# Altium schematic sheet Transceivers.SchDoc: Transceivers
size A3; CompanyName: Green Team Twente; Organization: Green Team Twente; Revision: V1.1; SheetNumber: 6; SheetTotal: 10; Team: 2024; Subsystem: Embedded Systems; SPICEModelCacheTCQGJEKV: <root> / <DocumentId>TCQGJEKV</DocumentId> / </root>
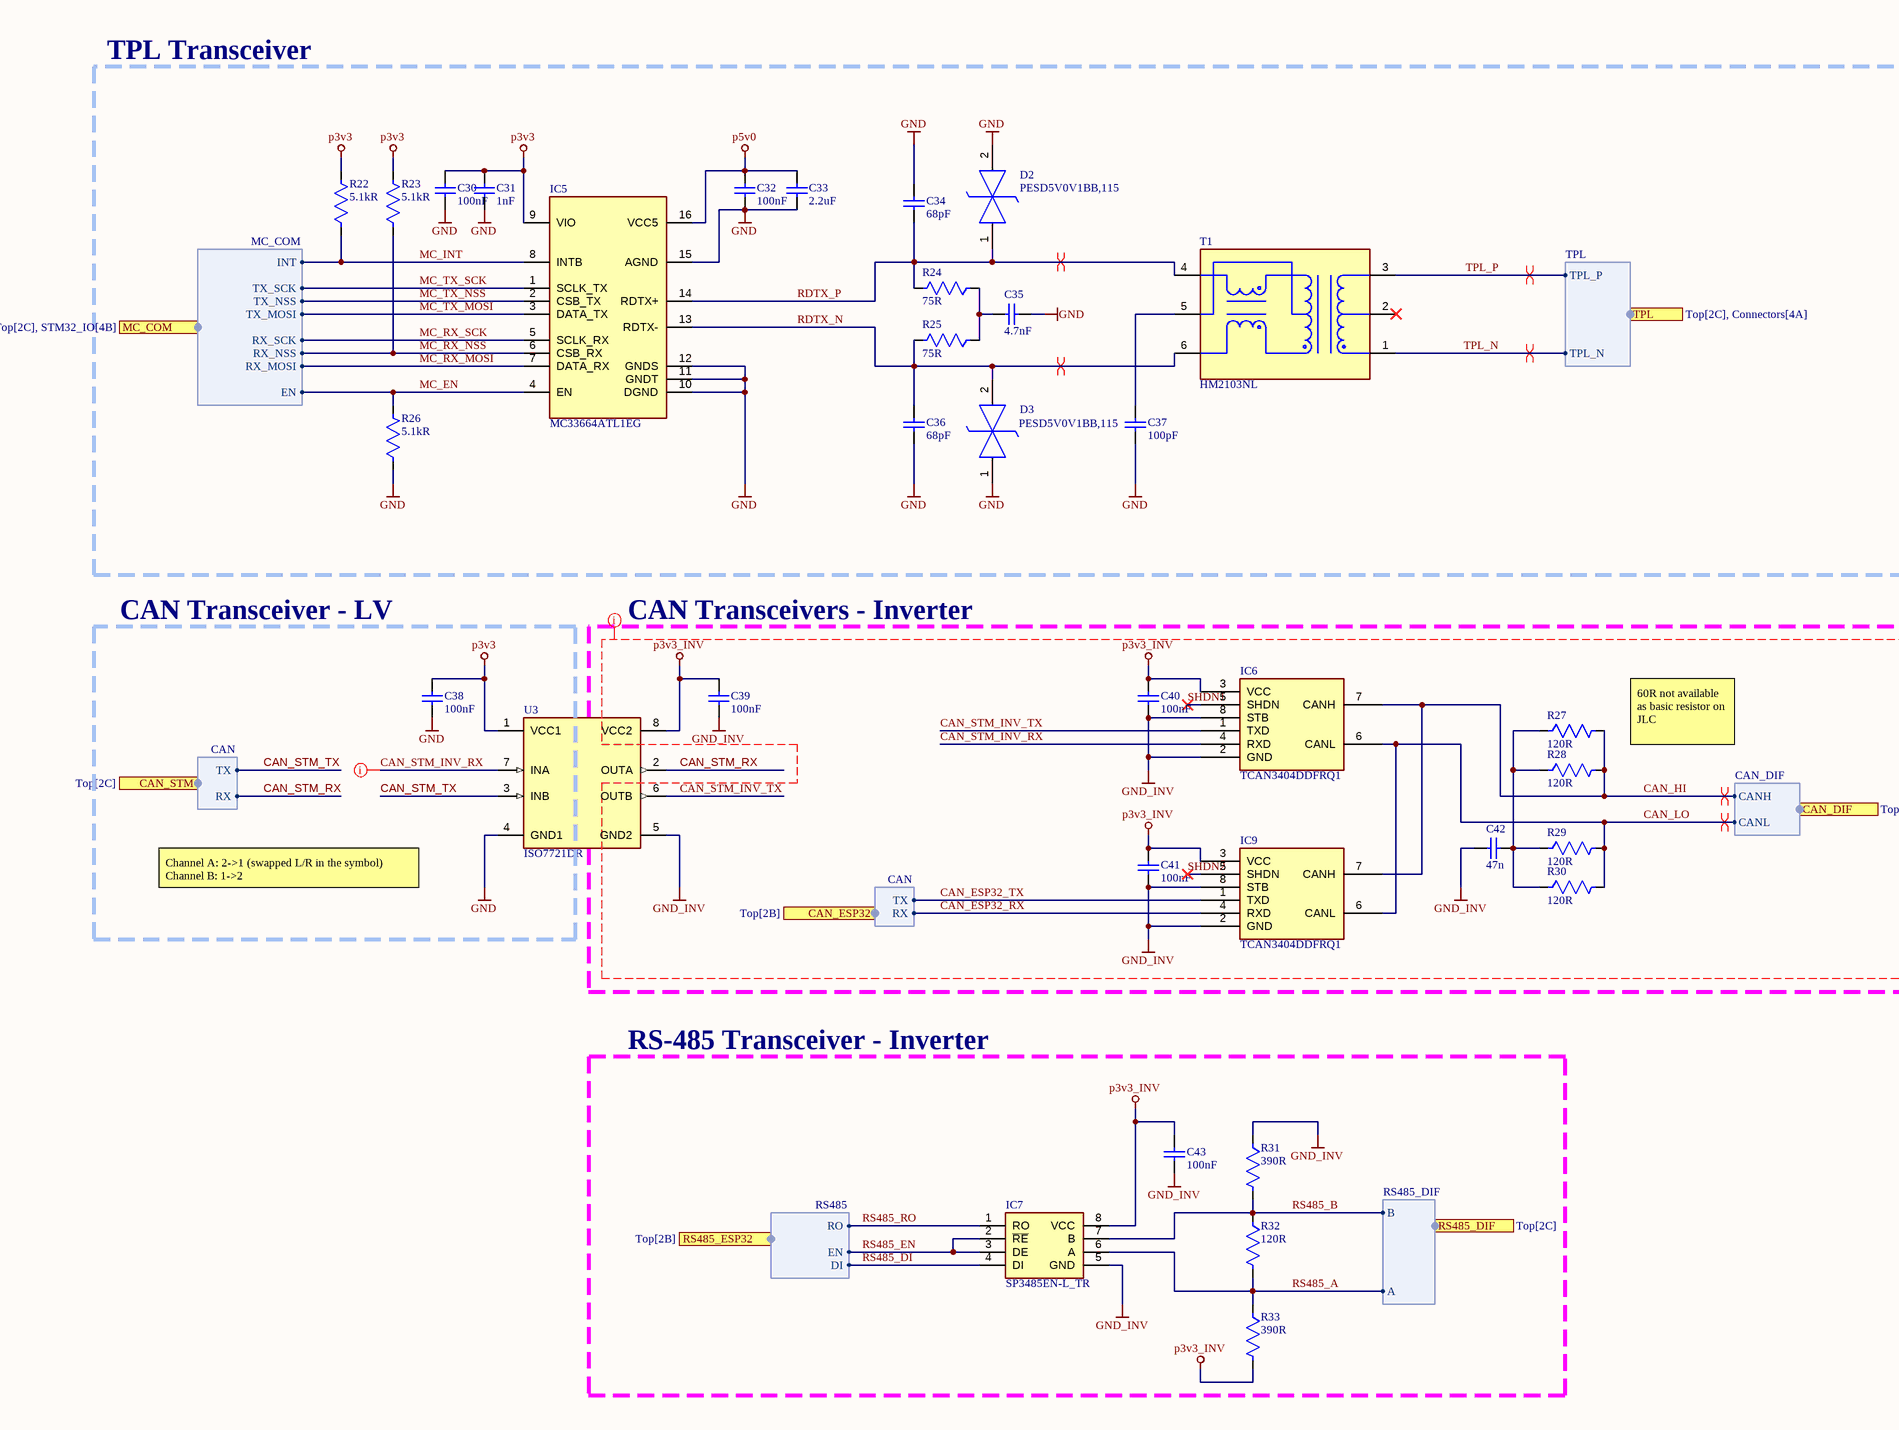
[diagram p0: Transceivers.SchDoc, left]
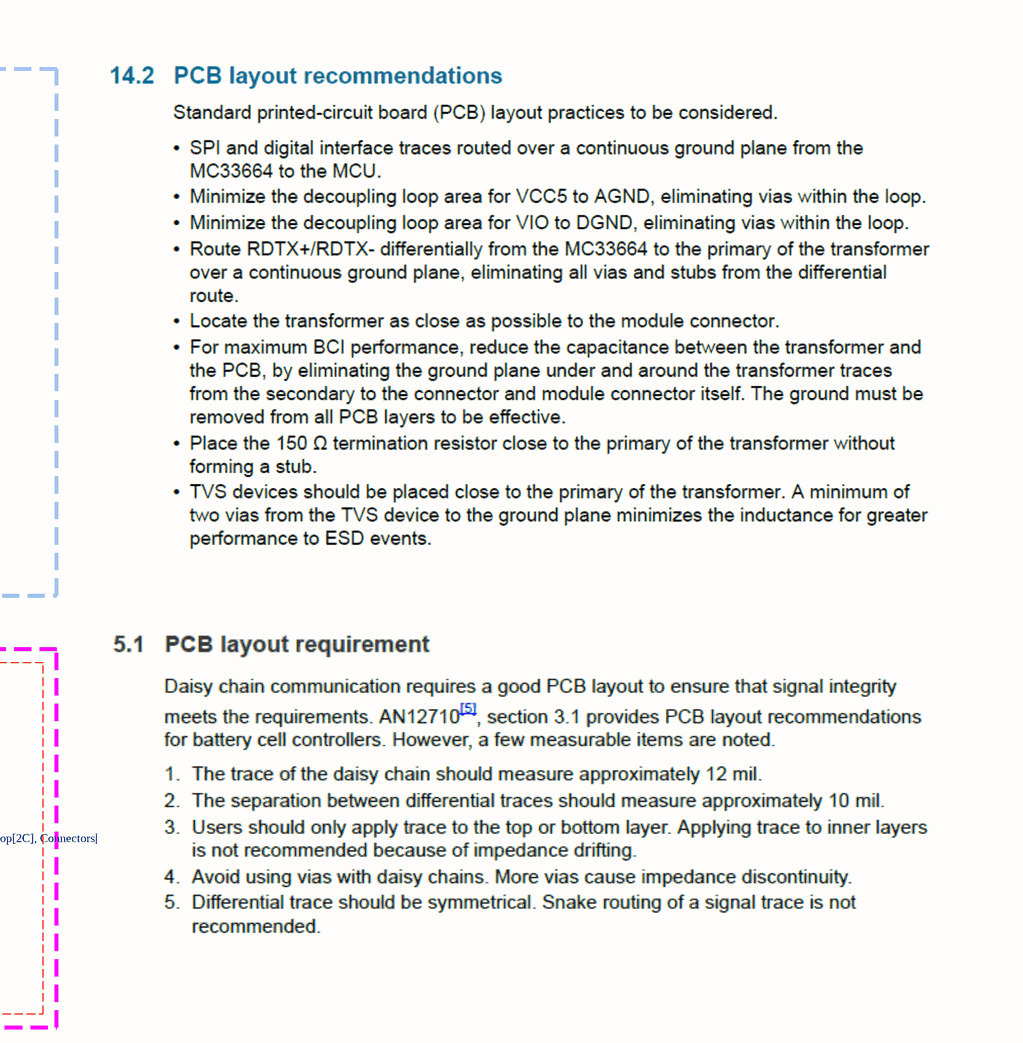
[diagram p1: Transceivers.SchDoc, right]

## Parts
C30  value 100nF  [WCAP-CSGP_0402_L1W0.5H0.5]  (hidden comment: CAP 0402 100nF X7R)
C31  value 1nF  [WCAP-CSGP_0402_L1W0.5H0.5]  (hidden comment: CAP 0402 1nF X7R)
C32  value 100nF  [WCAP-CSGP_0402_L1W0.5H0.5]  (hidden comment: CAP 0402 100nF X7R)
C33  value 2.2uF  [WCAP-CSGP_0603_L1.6W0.8H0.8_Reflow]  (hidden comment: CAP 0603 2.2uF X7R)
C34  value 68pF  [WCAP-CSGP_0402_L1W0.5H0.5]  (hidden comment: CAP 0402 68pF X7R)
C35  value 4.7nF  [WCAP-CSGP_0402_L1W0.5H0.5]  (hidden comment: CAP 0402 4.7nF X7R)
C36  value 68pF  [WCAP-CSGP_0402_L1W0.5H0.5]  (hidden comment: CAP 0402 68pF X7R)
C37  value 100pF  [WCAP-CSGP_0402_L1W0.5H0.5]  (hidden comment: CAP 0402 100pF X7R)
C38  value 100nF  [WCAP-CSGP_0402_L1W0.5H0.5]  (hidden comment: CAP 0402 100nF X7R)
C39  value 100nF  [WCAP-CSGP_0402_L1W0.5H0.5]  (hidden comment: CAP 0402 100nF X7R)
C40  value 100nF  [WCAP-CSGP_0402_L1W0.5H0.5]  (hidden comment: CAP 0402 100nF X7R)
C41  value 100nF  [WCAP-CSGP_0402_L1W0.5H0.5]  (hidden comment: CAP 0402 100nF X7R)
C42  value 47n  [WCAP-CSGP_0603_L1.6W0.8H0.8_Reflow]  (hidden comment: CAP 0603 47n X7R)
C43  value 100nF  [WCAP-CSGP_0402_L1W0.5H0.5]  (hidden comment: CAP 0402 100nF X7R)
D2  PESD5V0V1BB,115  [PESD5V0V1BB115]
D3  PESD5V0V1BB,115  [PESD5V0V1BB115]
IC5  MC33664ATL1EG  [SOIC127P600X175-16N]
IC6  TCAN3404DDFRQ1  [TSOT-23-8]
IC7  SP3485EN-L_TR  [SOIC127P600X175-8N]
IC9  TCAN3404DDFRQ1  [TSOT-23-8]
R22  value 5.1kR  [FP0402]  (hidden comment: RES 0402 5.1kR 1%)
R23  value 5.1kR  [FP0402]  (hidden comment: RES 0402 5.1kR 1%)
R24  value 75R  [RES_SM0603_YAGEORC_N]  (hidden comment: RES 0603 75R 1%)
R25  value 75R  [RES_SM0603_YAGEORC_N]  (hidden comment: RES 0603 75R 1%)
R26  value 5.1kR  [FP0402]  (hidden comment: RES 0402 5.1kR 1%)
R27  value 120R  [RES_SM0603_YAGEORC_N]  (hidden comment: RES 0603 120R 1%)
R28  value 120R  [RES_SM0603_YAGEORC_N]  (hidden comment: RES 0603 120R 1%)
R29  value 120R  [RES_SM0603_YAGEORC_N]  (hidden comment: RES 0603 120R 1%)
R30  value 120R  [RES_SM0603_YAGEORC_N]  (hidden comment: RES 0603 120R 1%)
R31  value 390R  [RES_SM0603_YAGEORC_N]  (hidden comment: RES 0603 390R 1%)
R32  value 120R  [RES_SM0603_YAGEORC_N]  (hidden comment: RES 0603 120R 1%)
R33  value 390R  [RES_SM0603_YAGEORC_N]  (hidden comment: RES 0603 390R 1%)
T1  HM2103NL  [FP-HM2103NL-MFG]
U3  ISO7721DR  [FP-D0008B-MFG]

## Blocks framed on the sheet
TPL Transceiver: C30-C37 D2 D3 IC5 R22-R26 T1
CAN Transceiver - LV: C38
CAN Transceivers - Inverter: C39-C42 IC6 IC9 R27-R30
RS-485 Transceiver - Inverter: C43 IC7 R31-R33

## Ports
CAN_DIF (out, harness CAN_DIF, see Top[2C], Connectors[1A]), CAN_ESP32 (out, harness CAN, see Top[2B]), CAN_STM (out, harness CAN, see Top[2C]), MC_COM (out, harness MC_COM, see Top[2C], STM32_IO[4B]), RS485_DIF (out, harness RS485_DIF, see Top[2C]), RS485_ESP32 (out, harness RS485, see Top[2B]), TPL (out, harness TPL, see Top[2C], Connectors[4A])

## Harnesses
CAN: RX, TX
MC_COM: INT, TX_SCK, TX_NSS, TX_MOSI, RX_SCK, RX_NSS, RX_MOSI, EN
CAN_DIF: CANH, CANL
TPL: TPL_P, TPL_N
CAN: TX, RX
RS485_DIF: A, B
RS485: RO, EN, DI

## Nets
GND: C30.1 C31.1 C32.1 C33.1 C34.2 C35.1 C36.1 C37.1 C38.1 D2.2(K2) D3.1(K1) IC5.10(DGND) IC5.11(GNDT) IC5.12(GNDS) IC5.15(AGND) R26.1 U3.4(GND1)
GND_INV: C39.1 C40.1 C41.1 C42.2 C43.1 IC6.2(GND) IC6.8(STB) IC7.5(GND) IC9.2(GND) IC9.8(STB) R31.1 U3.5(GND2)
p3v3: C30.2 C31.2 C38.2 IC5.9(VIO) R22.2 R23.2 U3.1(VCC1)
p3v3_INV: C39.2 C40.2 C41.2 C43.2 IC6.3(VCC) IC7.8(VCC) IC9.3(VCC) R33.2 U3.8(VCC2)
p5v0: C32.2 C33.2 IC5.16(VCC5)
CAN_ESP32_RX: IC9.4(RXD) ; port CAN_ESP32.RX
CAN_ESP32_TX: IC9.1(TXD) ; port CAN_ESP32.TX
CAN_HI: IC6.7(CANH) IC9.7(CANH) R27.2 R28.2 ; port CAN_DIF.CANH
CAN_LO: IC6.6(CANL) IC9.6(CANL) R29.2 R30.2 ; port CAN_DIF.CANL
CAN_STM_INV_RX: IC6.4(RXD) U3.7(INA)
CAN_STM_INV_TX: IC6.1(TXD) U3.6(OUTB)
CAN_STM_RX: U3.2(OUTA) ; port CAN_STM.RX
CAN_STM_TX: U3.3(INB) ; port CAN_STM.TX
MC_EN: IC5.4(EN) R26.2 ; port MC_COM.EN
MC_INT: IC5.8(INTB) R22.1 ; port MC_COM.INT
MC_RX_MOSI: IC5.7(DATA_RX) ; port MC_COM.RX_MOSI
MC_RX_NSS: IC5.6(CSB_RX) R23.1 ; port MC_COM.RX_NSS
MC_RX_SCK: IC5.5(SCLK_RX) ; port MC_COM.RX_SCK
MC_TX_MOSI: IC5.3(DATA_TX) ; port MC_COM.TX_MOSI
MC_TX_NSS: IC5.2(CSB_TX) ; port MC_COM.TX_NSS
MC_TX_SCK: IC5.1(SCLK_TX) ; port MC_COM.TX_SCK
RDTX_N: C36.2 D3.2(K2) IC5.13(RDTX-) R25.2 T1.6
RDTX_P: C34.1 D2.1(K1) IC5.14(RDTX+) R24.2 T1.4
RS485_A: IC7.6(A) R32.2 R33.1 ; port RS485_DIF.A
RS485_B: IC7.7(B) R31.2 R32.1 ; port RS485_DIF.B
RS485_DI: IC7.4(DI) ; port RS485_ESP32.DI
RS485_EN: IC7.2(~{RE}) IC7.3(DE) ; port RS485_ESP32.EN
RS485_RO: IC7.1(RO) ; port RS485_ESP32.RO
SHDN1: IC6.5(SHDN)
SHDN2: IC9.5(SHDN)
TPL_N: T1.1 ; port TPL.TPL_N
TPL_P: T1.3 ; port TPL.TPL_P
NetC35_2: C35.2 R24.1 R25.1
NetC37_2: C37.2 T1.5
NetC42_1: C42.1 R27.1 R28.1 R29.1 R30.1

Not connected (* = marked no-connect by the designer): T1 2*

## Layout directives
differential pair; differential pair class CAN120; rule Clearance Constraint [Generic clearance = 0.15mm, and 12 value(s) for objects]: CAN_HI, CAN_LO
differential pair; differential pair class TPL100; rule Clearance Constraint [Generic clearance = 0.15mm, and 12 value(s) for objects]: RDTX_N, RDTX_P, TPL_N, TPL_P
net class INV: CAN_ESP32_RX, CAN_ESP32_TX, CAN_HI, CAN_LO, CAN_STM_INV_RX, CAN_STM_INV_TX, GND_INV, p3v3_INV, SHDN1, SHDN2

## Notes on the sheet
- 60R not available as basic resistor on JLC
- Channel A: 2->1 (swapped L/R in the symbol)
  Channel B: 1->2
- Team
- Authors
- Revision
- Title
- Project
- Subsystem
- File
- Sheet
- //

## Library data of the parts
C30-C32 C34-C41 C43 = CMP-001-01308-5: GTT Standard 0402 non-polarized capacitor; Pins: 2; Case/Package: 0402; Category: Multilayer Ceramic Chip Capacitors; Ceramic Type: X7R; ClassName: TPL_Trans
  C30 C32 C38-C41 C43: JLCPCB Part #: C1525
  C31: JLCPCB Part #: C1523
  C34 C36: JLCPCB Part #: C190580
  C35: JLCPCB Part #: C1538
  C37: JLCPCB Part #: C1546
C33 C42 = CMP-001-01309-1: GTT Standard 0603 non-polarized capacitor; Case/Package: 0603; Category: Multilayer Ceramic Chip Capacitors; Ceramic Type: X7R; Pins: 2
  C33: ClassName: TPL_Trans; JLCPCB Part #: C23630
  C42: JLCPCB Part #: C1622
D2 D3 = CMP-004-00097-1: PESD5V0V1BB - Very low capacitance bidirectional ESD protection diode; Manufacturer_Name: Nexperia; Arrow Price/Stock: https://www.arrow.com/en/products/pesd5v0v1bb115/nexperia?region=nac; Design Item ID: PESD5V0V1BB,115; Height: 0.65mm; Manufacturer_Part_Number: PESD5V0V1BB,115; Mouser Price/Stock: https://www.mouser.co.uk/ProductDetail/Nexperia/PESD5V0V1BB115?qs=GcY6OjH1zdkfLKV5vNnV%252BA%3D%3D; Datasheet Link: https://assets.nexperia.com/documents/data-sheet/PESD5V0V1BB.pdf; Mouser Part Number: 771-PESD5V0V1BB115; Source: TempSchematics.schlib; Arrow Part Number: PESD5V0V1BB,115
IC5 = CMP-031-00034-2: Interface - Specialized Isolated network high speed transceiver; Manufacturer_Name: NXP; Height: 1.75mm; Source: TempSchematics.schlib; Arrow Part Number: MC33664ATL1EG; Mouser Part Number: 841-MC33664ATL1EG; Mouser Price/Stock: https://www.mouser.co.uk/ProductDetail/NXP-Semiconductors/MC33664ATL1EG?qs=ifm8N2KdrcYav8QSnSftXQ%3D%3D; Design Item ID: MC33664ATL1EG; Datasheet Link: http://www.nxp.com/docs/en/data-sheet/MC33664_SDS.pdf; Manufacturer_Part_Number: MC33664ATL1EG; Arrow Price/Stock: https://www.arrow.com/en/products/mc33664atl1eg/nxp-semiconductors?region=nac
IC6 IC9 = TCAN3404DDFRQ1: Integrated Circuit; Manufacturer_Name: TI; Datasheet Link: https://www.ti.com/lit/ds/symlink/tcan3404-q1.pdf; Height: 1.1mm; Manufacturer_Part_Number: TCAN3404DDFRQ1; JLCPCB Part #: C32428067
IC7 = SP3485EN-L_TR: Integrated Circuit; Manufacturer_Name: MaxLinear; Manufacturer_Part_Number: SP3485EN-L/TR; Datasheet Link: https://www.maxlinear.com/ds/sp3485.pdf; Height: 1.75mm; Mouser Part Number: 701-SP3485EN-L/TR; Mouser Price/Stock: https://www.mouser.co.uk/ProductDetail/MaxLinear/SP3485EN-L-TR?qs=3EMgrMjM0fbQ17liGrle%2Fg%3D%3D; Arrow Part Number: SP3485EN-L/TR; Arrow Price/Stock: https://www.arrow.com/en/products/sp3485en-ltr/maxlinear-inc?region=nac; JLCPCB Part #: C8963
R22 R23 R26 = CMP-009-00204-17: GTT Standard 0402 Resistor; Voltage Rating: 50V; Power: 62.5mW; Mounting Technology: SMD; Tolerance: 1%; Case/Package: 0402; Design Item ID: RES 0402; Source: Passives.SchLib; JLCPCB Part #: C25905
R24 R25 R27-R33 = CMP-009-00206-3: GTT Standard 0603 Resistor; Voltage Rating: 50V; Power: 62.5mW; Case/Package: 0603; Tolerance: 1%; Mounting Technology: SMD
  R24 R25: JLCPCB Part #: C4275
  R27-R30 R32: JLCPCB Part #: C22787
  R31 R33: JLCPCB Part #: C23151
T1 = CMP-16309-000039-1: XFMR CMC MODULE AECQ BATT MNGT; Obsolete Part: false; Manufacturer: Pulse; Isolation Voltage: 4300VDC; Automotive Grade: Grade 1; Turns Ratio: 1:1; Standoff Height: 0.13mm; Insertion Loss: 0.25dB; Return Loss: 20dB; Inductance Primary: 150uH; Device Class L2: Transformers; Automotive: Yes; RoHS: TRUE; Device Class L1: Passive Components; Digikey Description: XFMR CMC MODULE AECQ BATT MNGT; Package: 0; Manufacturer Part Number: HM2103NL; Height: 5.72mm; Temperature Range High: +125°C; Temperature Range Low: -40°C; Category: Trans; Temperature: -40°C to +125°C; Lead Free: Yes; ComponentLink2URL: https://productfinder.pulseeng.com/product/HM2103NL; Octopart: https://octopart.com/hm2103nl-pulse-87646222; Device Class L3: unset; ComponentLink2Description: Datasheet; ClassName: TPL_Trans; JLCPCB Part #: C962543
U3 = CMP-04872-000019-2: DGTL ISO 3KV GEN PRP 8SOIC; Isolated Power: No; Channel Type: Unidirectional; Pulse Width Distortion (PWD): 4.9ns; Propagation Delay: 16ns; Number of Channels: 2; Data Rate: 100Mbps; Case/Package: SOIC; Number of Pins: 8; Min Operating Temperature: -55°C; Max Operating Temperature: 125°C; Type: General Purpose; Packaging: Tape and Reel; Mount: Surface Mount